# EasyEDA Pro project 射频开关hmc241.eprj

# Schematic Schematic1
Create Date: 2023-07-17; Page Name: P1; Project Name: 射频开关hmc241; Schematic Name: Schematic1; Update Date: 2023-07-18; Company: 嘉立创EDA; Page Size: A4; Version: V1.0
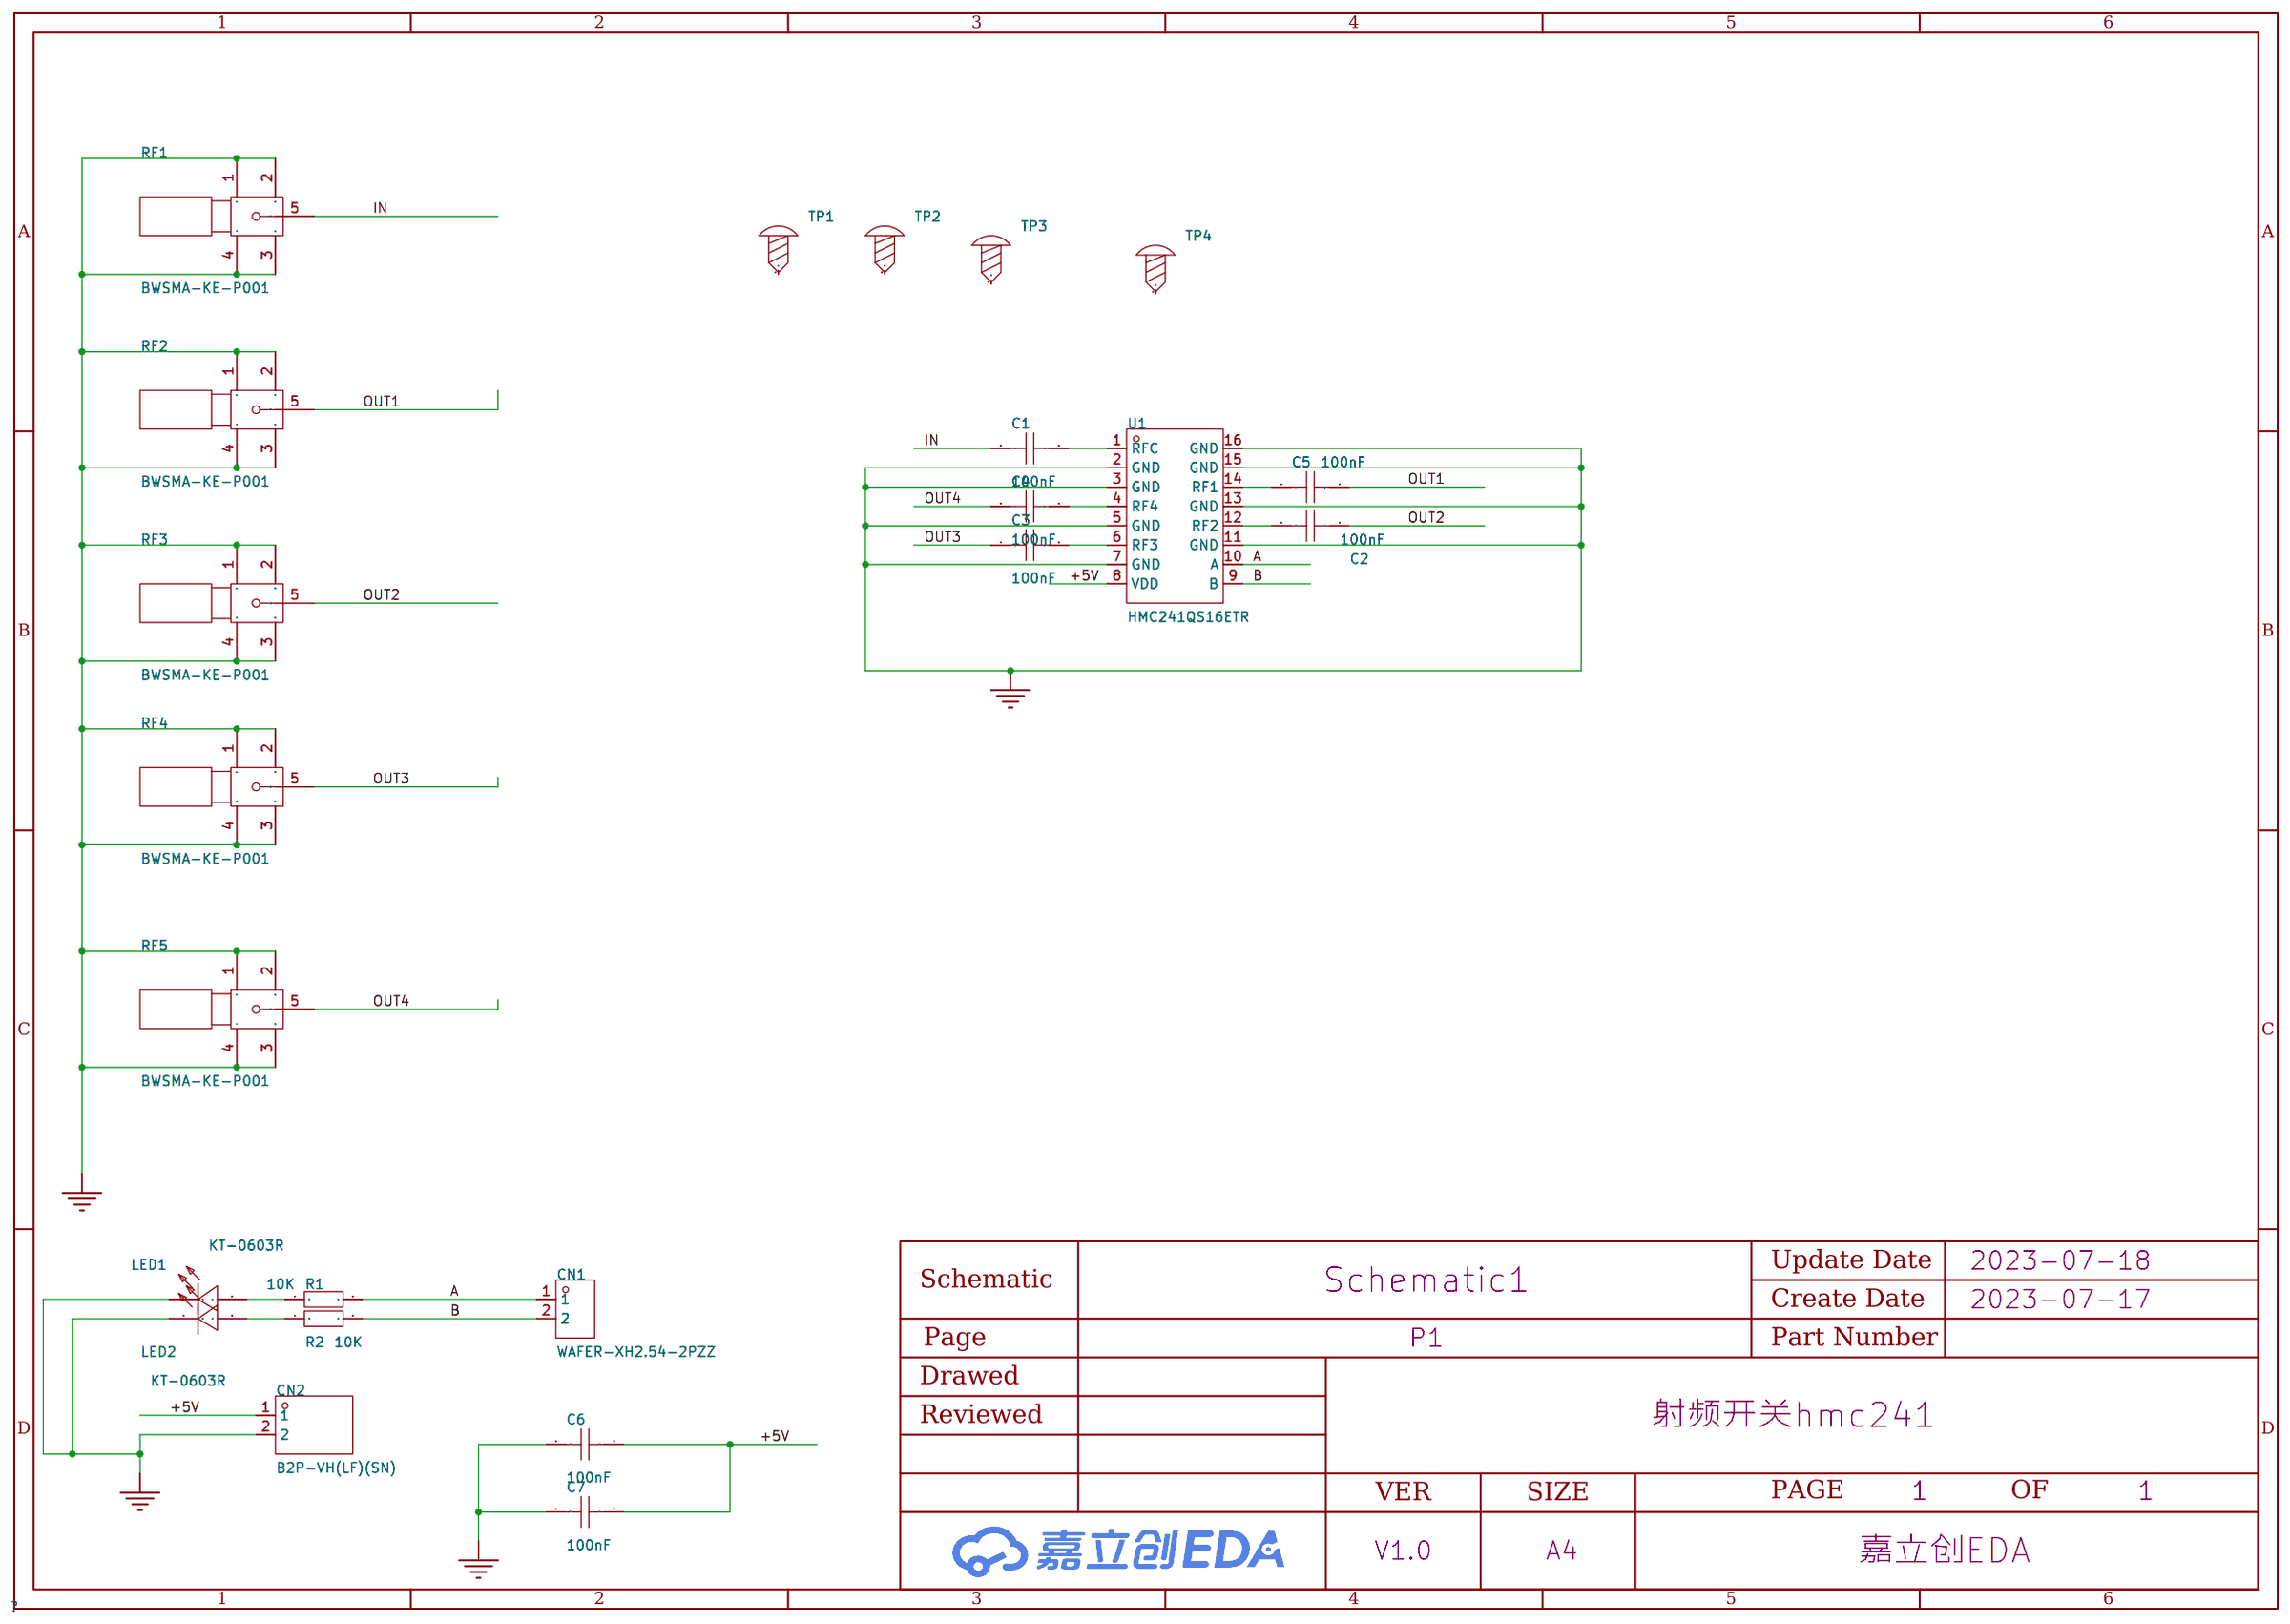
[diagram p0: schematic sheet]

## Parts
C1  100nF  [C0603]
C2  100nF  [C0603]
C3  100nF  [C0603]
C4  100nF  [C0603]
C5  100nF  [C0603]
C6  100nF  [C0603]
C7  100nF  [C0603]
CN1  WAFER-XH2.54-2PZZ  [CONN-TH_XH2.54-2P]
CN2  B2P-VH(LF)(SN)  [CONN-TH_B2P-VH-LF-SN]
LED1  KT-0603R  [LED0603-RD]
LED2  KT-0603R  [LED0603-RD]
R1  10K  [R0603]
R2  10K  [R0603]
RF1  BWSMA-KE-P001  [SMA-SMD_BWSMA-KE-P001]
RF2  BWSMA-KE-P001  [SMA-SMD_BWSMA-KE-P001]
RF3  BWSMA-KE-P001  [SMA-SMD_BWSMA-KE-P001]
RF4  BWSMA-KE-P001  [SMA-SMD_BWSMA-KE-P001]
RF5  BWSMA-KE-P001  [SMA-SMD_BWSMA-KE-P001]
TP1  -  [M3螺丝]
TP2  -  [M3螺丝]
TP3  -  [M3螺丝]
TP4  -  [M3螺丝]
U1  HMC241QS16ETR  [QSOP-16_L4.9-W3.9-P0.64-LS6.0-BL]

## Library data of the parts
C1-C7 = CAP_0603: Supplier Footprint: 0603
CN1 = WAFER-XH2.54-2PZZ: 间距：2.54mm 插针结构：1x2P 排数：1 每排PIN数：2 公母：公型插针 安装方式：直插 额定电流：1A 工作温度范围：-25℃~+85℃  XH 2.54mm 1x2P 直插   配套：WAFER-XH2.54-2PJK  WAFER-XH2.54-DZ; LCSC Part Name: XH 2.54mm 1x2P 直插; Supplier Part: C5359631; Manufacturer: XUNPU(讯普); Supplier Footprint: 插件,P=2.54mm; JLCPCB Part Class: Extended Part; Datasheet: https://atta.szlcsc.com/upload/public/pdf/source/20230221/5D6483F9C7001DB87CFCFC787E1DC139.pdf; Supplier: LCSC
CN2 = B2P-VH (LF)(SN): 参考系列:VH;间距:3.96mm;插针结构:1x2P;排数:1;每排PIN数:2;行距:-;安装方式:-;触头材质:黄铜;; LCSC Part Name: VH 3.96mm 1x2P 直插; Supplier Part: C160315; Manufacturer: JST; Supplier Footprint: 插件,P=3.96mm; JLCPCB Part Class: Extended Part; Datasheet: https://atta.szlcsc.com/upload/public/pdf/source/20180420/C160315_19C451141449BB9E1CAF8D49BAD03192.pdf; Supplier: LCSC; Reference Series: VH; Pitch: 3.96mm; Pins Structure: 1x2P; Number of Rows: 1; Number of PINs Per Row: 2; Contact Material: 黄铜
LED1 LED2 = KT-0603R: 发光颜色:红灯;二极管配置:-;透镜颜色:-;主波长:-;色温:-;功率:-;发光角度:-;安装方式:-;工作温度:-40℃~+85℃;; LCSC Part Name: 0603 红灯 高亮; Supplier Part: C2286; Manufacturer: KENTO; Supplier Footprint: 0603; JLCPCB Part Class: 基础库; Datasheet: https://atta.szlcsc.com/upload/public/pdf/source/20160616/1466072038404.pdf; Supplier: LCSC; Emitted Color: 红灯; Operating Temperature: -40℃~+85℃
R1 R2 = Res_0603: Supplier Footprint: 0603
RF1-RF5 = BWSMA-KE-P001: 连接器类型:板端;射频系列:SMA;接口类型:内孔;端口数量:1;阻抗:50Ω;频率-最大值:12.4GHz;样式:偏脚;接口直径:5.2mm;接口长度/高度:-;工作温度范围:-;; LCSC Part Name: SMA 内孔 偏脚 SMA偏脚板端座子; Supplier Part: C496550; Manufacturer: BAT WIRELESS(蝙蝠无线); Supplier Footprint: 插件; JLCPCB Part Class: Extended Part; Datasheet: https://atta.szlcsc.com/upload/public/pdf/source/20200416/C496550_06668BF2E3B968EA39F96D17E7156373.pdf; Supplier: LCSC; Connector Type: 板端; RF Series: SMA; Interface Type: 内孔; Number of Ports: 1; Impedance: 50Ω; Frequency-Max: 12.4GHz; Style: 偏脚; Interface Diameter: 5.2mm
TP1-TP4 = M3螺丝: Supplier Footprint: 插件
U1 = HMC241QS16ETR: Supplier Part: C2836710; Supplier Footprint: QSOP-16(3.9x4.9x0.64mm); JLCPCB Part Class: 扩展库; Datasheet: 2021-05-22/641668A/694ce039841a40c4b13c8f5b58ece109/hmc241qs16.pdf; Supplier: LCSC

## Nets
+5V: C6.2 C7.2 CN2.1 U1.8(VDD)
GND: C6.1 C7.1 CN2.2 LED1.1(K) LED2.1(K) RF1.1 RF1.2 RF1.3 RF1.4 RF2.1 RF2.2 RF2.3 RF2.4 RF3.1 RF3.2 RF3.3 RF3.4 RF4.1 RF4.2 RF4.3 RF4.4 RF5.1 RF5.2 RF5.3 RF5.4 U1.2(GND) U1.3(GND) U1.5(GND) U1.7(GND) U1.11(GND) U1.13(GND) U1.15(GND) U1.16(GND)
A: CN1.1 R1.2 U1.10(A)
B: CN1.2 R2.2 U1.9(B)
IN: C1.1 RF1.5
OUT1: C5.2 RF2.5
OUT2: C2.2 RF3.5
OUT3: C3.1 RF4.5
OUT4: C4.1 RF5.5
$1N325: C1.2 U1.1(RFC)
$1N328: C4.2 U1.4(RF4)
$1N331: C3.2 U1.6(RF3)
$1N343: C5.1 U1.14(RF1)
$1N349: C2.1 U1.12(RF2)
$1N1554: LED1.2(A) R1.1
$1N1585: LED2.2(A) R2.1

Not connected (* = marked no-connect by the designer): TP1 1; TP2 1; TP3 1; TP4 1

# Board PCB1
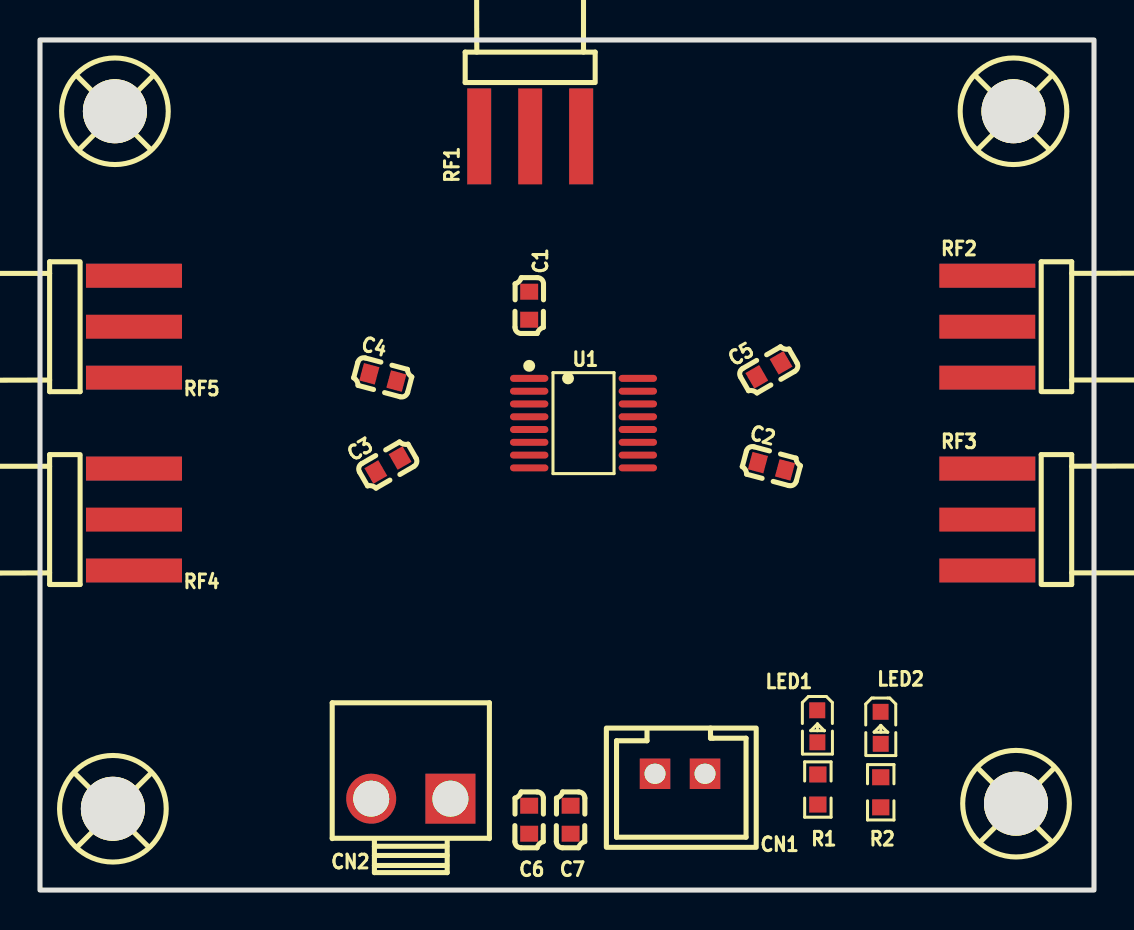
[diagram p1: board, top side]
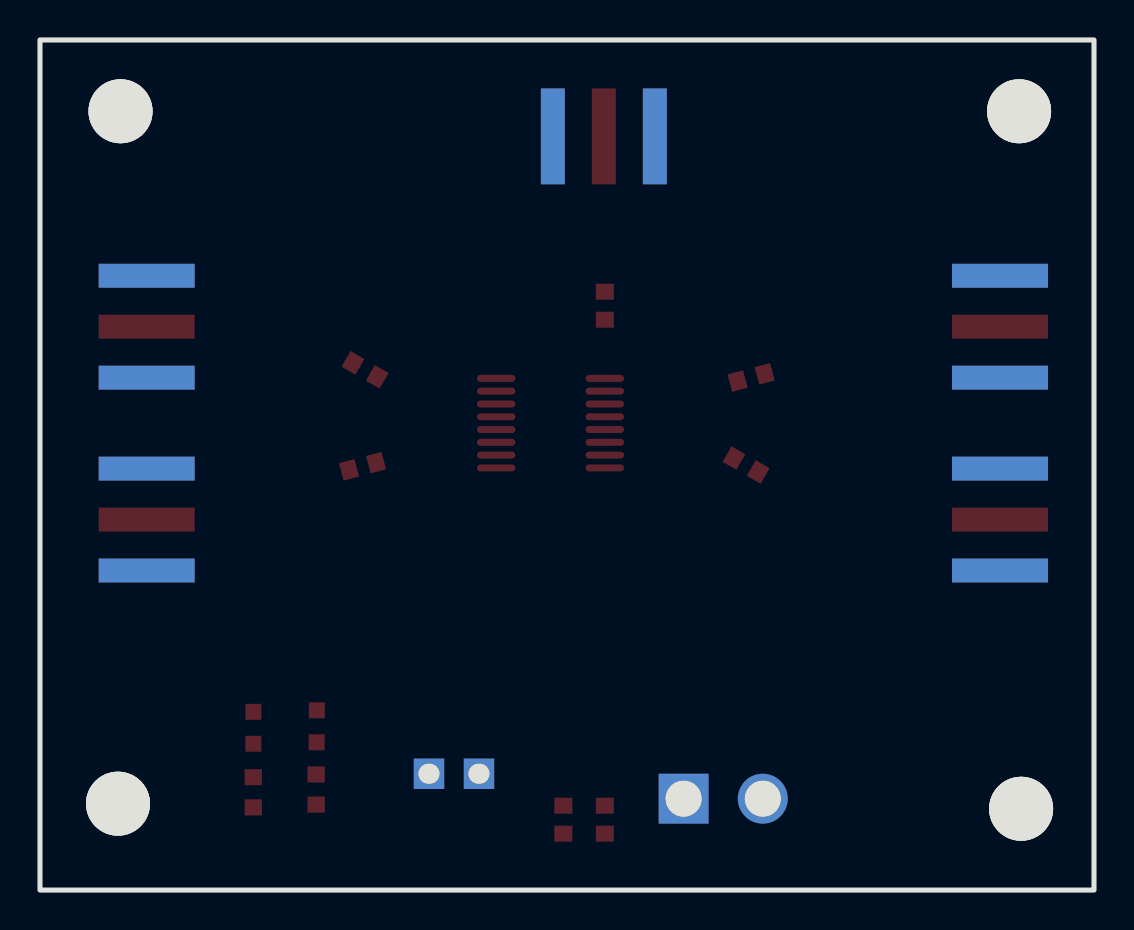
[diagram p2: board, bottom side, seen from below]

Outline 52.7 x 42.55 mm; copper layers: Top Layer, Inner9, Inner10, Inner11, Inner12, Inner13, Inner14, Inner15, Inner16, Inner17, Inner18, Inner19, Inner20, Inner21, Inner22, Inner23, Inner24, Inner25, Inner26, Inner27, Inner28, Inner29, Inner30, Bottom Layer. Coordinates in mm from the lower left corner of the outline.
Outline path: rectangle 0,42.55 52.7,0
Stack: Top Layer 0.035mm / Dielectric1 1.51mm FR4 er 4.5 / Bottom Layer 0.035mm

## Design rules (mm)
template: 自定义配置
spacing copperThickness1oz (default): track to track 0.102, other pairs 0.152 to 0.3
spacing copperThickness2oz: track to track 0.203, other pairs 0.152 to 0.3
track width copperThickness1oz (default): min 0.127, default 0.254, max 2.54
track width copperThickness2oz: min 0.203, default 0.254, max 2.54
differential pair differentialPair (default): width min 0.127, default 0.254, max 2.54; gap min 0.152, default 0.152
via viaSize (default): diameter min 0.5, default 0.61, max 10; hole min 0.3, default 0.305, max 6.299

## Placement (name value [footprint] x y rotation side)
C1  100nF  [C0603]  24.46 29.24 270 top
C2  100nF  [C0603]  36.58 21.21 345 top
C3  100nF  [C0603]  17.4 21.27 30 top
C4  100nF  [C0603]  17.15 25.65 345 top
C5  100nF  [C0603]  36.45 26.03 30 top
C6  100nF  [C0603]  24.46 3.52 90 top
C7  100nF  [C0603]  26.53 3.52 90 top
CN1  WAFER-XH2.54-2PZZ  [CONN-TH_XH2.54-2P]  32 5.82 180 top
CN2  B2P-VH(LF)(SN)  [CONN-TH_B2P-VH-LF-SN]  18.54 4.57 180 top
LED1  KT-0603R  [LED0603-RD]  38.87 8.2 270 top
LED2  KT-0603R  [LED0603-RD]  42.04 8.12 270 top
R1  10K  [R0603]  38.9 5.03 270 top
R2  10K  [R0603]  42.04 4.89 270 top
RF1  BWSMA-KE-P001  [SMA-SMD_BWSMA-KE-P001]  24.51 37.72 90 top
RF2  BWSMA-KE-P001  [SMA-SMD_BWSMA-KE-P001]  47.37 28.19 0 top
RF3  BWSMA-KE-P001  [SMA-SMD_BWSMA-KE-P001]  47.37 18.54 0 top
RF4  BWSMA-KE-P001  [SMA-SMD_BWSMA-KE-P001]  4.7 18.54 180 top
RF5  BWSMA-KE-P001  [SMA-SMD_BWSMA-KE-P001]  4.7 28.19 180 top
TP1  -  [M3螺丝]  3.81 38.91 0 top
TP2  -  [M3螺丝]  48.74 38.91 0 top
TP3  -  [M3螺丝]  3.71 4 0 top
TP4  -  [M3螺丝]  48.87 4.26 0 top
U1  HMC241QS16ETR  [QSOP-16_L4.9-W3.9-P0.64-LS6.0-BL]  27.18 23.37 270 top

## Footprints (pads in the part's own frame, mm; a bottom-side part is the same pattern mirrored in y, then rotated)
C0603
  rect 0.8x0.9 smd: 1(-0.7,0) 2(0.7,0)
CONN-TH_B2P-VH-LF-SN
  rect 2.5x2.5 hole 1.8: 1(-1.98,0)
  round 2.5 hole 1.8: 2(1.98,0)
CONN-TH_XH2.54-2P
  rect 1.524x1.524 hole 1.05x1: 1(-1.25,0) 2(1.25,0)
LED0603-RD
  rect 0.8x0.8 smd: 1(-0.799,-0.004) 2(0.799,0.004)
M3螺丝
  round 3.2 hole 3.2: 1(-0.064,0.064)
QSOP-16_L4.9-W3.9-P0.64-LS6.0-BL
  oval 0.35x1.921 smd: 1(-2.24,-2.716) 2(-1.6,-2.716) 3(-0.96,-2.716) 4(-0.32,-2.716) 5(0.32,-2.716) 6(0.96,-2.716) 7(1.6,-2.716) 8(2.24,-2.716) 9(2.24,2.716) 10(1.6,2.716) 11(0.96,2.716) 12(0.32,2.716) 13(-0.32,2.716) 14(-0.96,2.716) 15(-1.6,2.716) 16(-2.24,2.716)
R0603
  rect 0.806x0.864 smd: 1(-0.753,0) 2(0.753,0)
SMA-SMD_BWSMA-KE-P001
  rect 4.8x1.2 smd: 1(0,-2.55) 2(0,2.55) 5(0,0)
  rect 4.8x1.2 smd far side: 3(0,2.55) 4(0,-2.55)

## Nets
As in the schematic.

Pads without a net: TP1 1; TP2 1; TP3 1; TP4 1
